# Altium schematic sheet Project_Information.SchDoc: =project_title
size Tabloid; CompanyName: Luxonis Holding; Organization: Luxonis Holding; Address1: 1925 Harmony Park Drive; Address2: Westminster, CO; Address3: 80234; Address4: United States; SheetNumber: 2; SheetTotal: 13
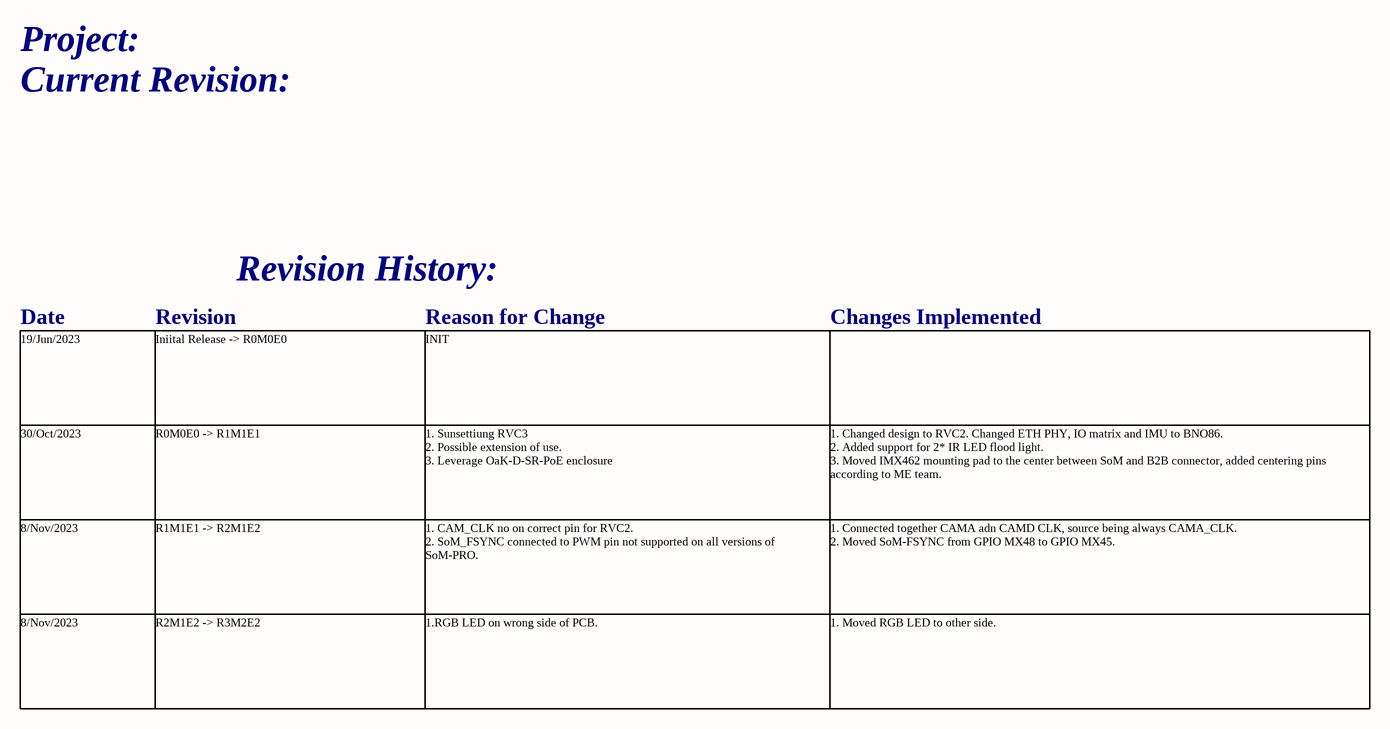
[diagram p0: Project_Information.SchDoc]

## Notes on the sheet
- Project:
- Current Revision:
- Revision History:
- Date
- Revision
- Reason for Change
- Changes Implemented
- 19/Jun/2023
- Iniital Release -> R0M0E0
- INIT
- 30/Oct/2023
- R0M0E0 -> R1M1E1
- 1. Sunsettiung RVC3
  2. Possible extension of use.
  3. Leverage OaK-D-SR-PoE enclosure
- 1. Changed design to RVC2. Changed ETH PHY, IO matrix and IMU to BNO86.
  2. Added support for 2* IR LED flood light.
  3. Moved IMX462 mounting pad to the center between SoM and B2B connector, added centering pins according to ME team.
- 8/Nov/2023
- R1M1E1 -> R2M1E2
- 1. CAM_CLK no on correct pin for RVC2.
  2. SoM_FSYNC connected to PWM pin not supported on all versions of SoM-PRO.
- 1. Connected together CAMA adn CAMD CLK, source being always CAMA_CLK.
  2. Moved SoM-FSYNC from GPIO MX48 to GPIO MX45.
- R2M1E2 -> R3M2E2
- 1.RGB LED on wrong side of PCB.
- 1. Moved RGB LED to other side.
- Title
- Size:
- Date:
- Tabloid
- Number:
- Time:
- Revision:
- Sheet
- of
- Drawn by: